# Altium project LNA.PrjPcb
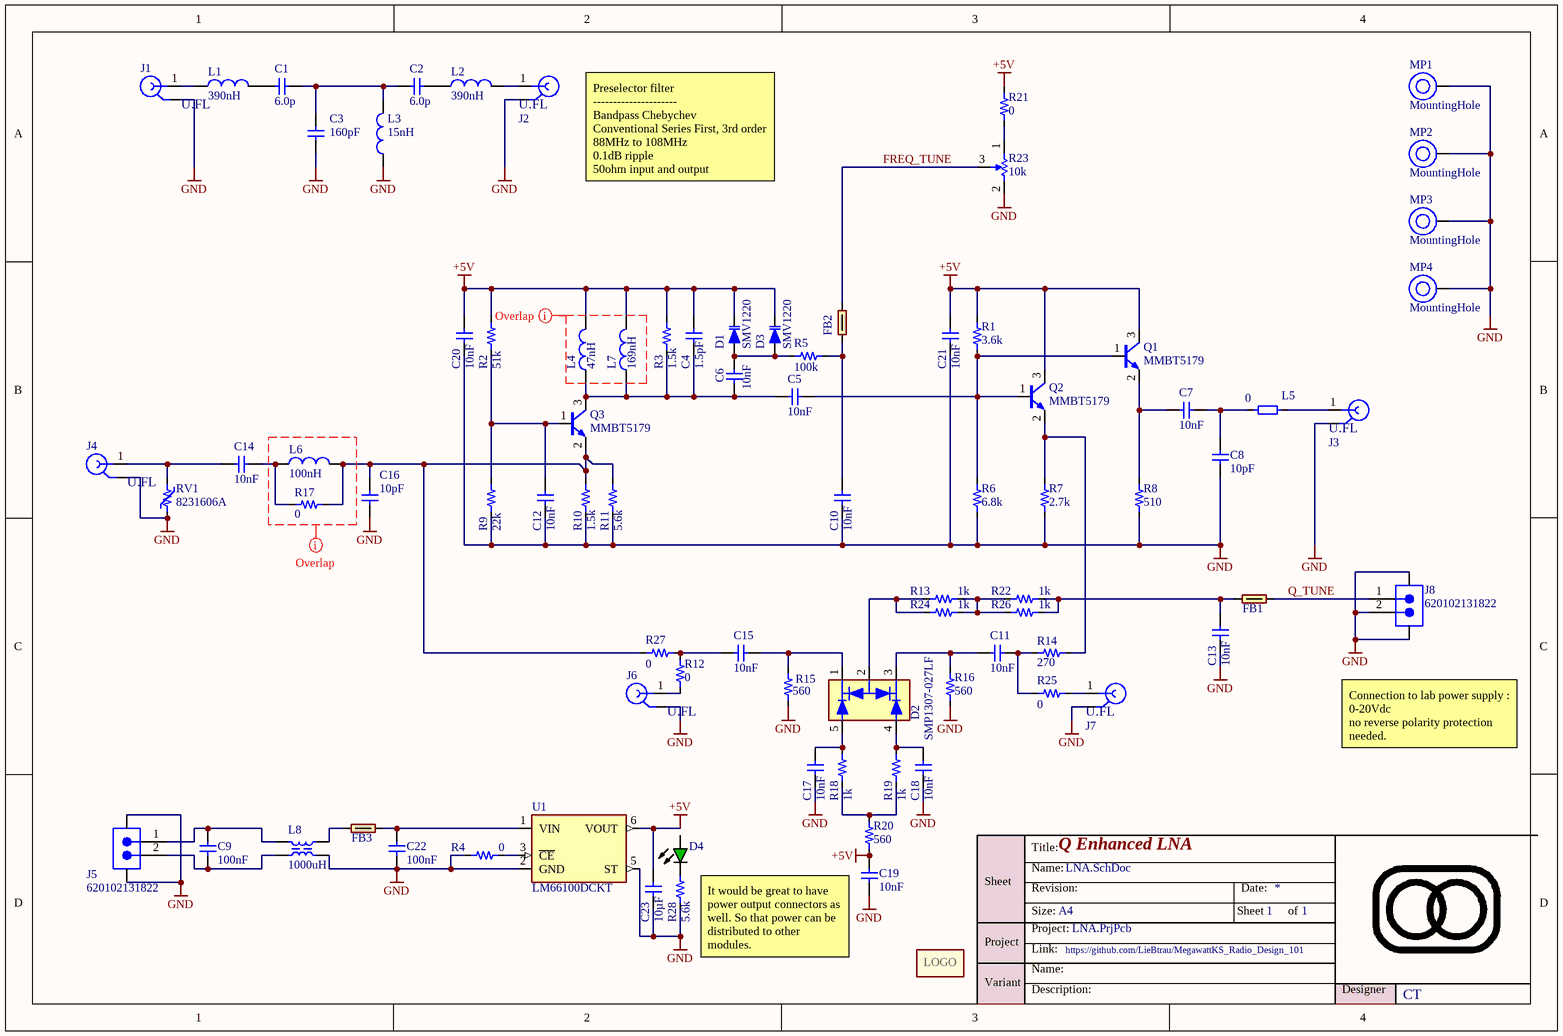
[diagram p0: LNA.SchDoc]
Project_link: https://github.com/LieBtrau/MegawattKS_Radio_Design_101; board_revision: 1.0; board_name: LNA; assembly_revision: 1
1 sheet, 84 parts. Net scope: global (net labels, ports and power ports of the same name join across sheets).
Board file: LNA.PcbDoc

## Sheet LNA.SchDoc: Q Enhanced LNA
size A4; Author: CT; Engineer: CT; SheetNumber: 1; SheetTotal: 1; SPICEModelCacheWKYEMNAT: <root> / <DocumentId>WKYEMNAT</DocumentId> / </root>

### Parts
C1  value 6.0p  [0603-C-L]  (hidden comment: AC0603CRNPO9BN6R0)
C2  value 6.0p  [0603-C-L]  (hidden comment: AC0603CRNPO9BN6R0)
C3  value 160pF  [0603-C-N]  (hidden comment: C0603C161F5GACTU)
C4  value 1.5pF  [0603-C-L]  (hidden comment: Capacitor 1.5pF +/-0.5pF 50V NP0 0603)
C5  value 10nF  [0603-C-N]  (hidden comment: Capacitor 10nF 50V NP0 0603)
C6  value 10nF  [0603-C-N]  (hidden comment: Capacitor 10nF 50V NP0 0603)
C7  value 10nF  [0603-C-N]  (hidden comment: Capacitor 10nF 50V NP0 0603)
C8  value 10pF  [0603-C-N]  (hidden comment: Capacitor 10pF +/-5% 50V NP0 0603)
C9  value 100nF  [0603-C-N]  (hidden comment: Capacitor 100nF +/-10% 50V X7R 0603)
C10  value 10nF  [0603-C-N]  (hidden comment: Capacitor 10nF 50V NP0 0603)
C11  value 10nF  [0603-C-N]  (hidden comment: Capacitor 10nF 50V NP0 0603)
C12  value 10nF  [0603-C-N]  (hidden comment: Capacitor 10nF 50V NP0 0603)
C13  value 10nF  [0603-C-N]  (hidden comment: Capacitor 10nF 50V NP0 0603)
C14  value 10nF  [0603-C-N]  (hidden comment: Capacitor 10nF 50V NP0 0603)
C15  value 10nF  [0603-C-N]  (hidden comment: Capacitor 10nF 50V NP0 0603)
C16  value 10pF  [0603-C-N]  (hidden comment: Capacitor 10pF +/-5% 50V NP0 0603)
C17  value 10nF  [0603-C-N]  (hidden comment: Capacitor 10nF 50V NP0 0603)
C18  value 10nF  [0603-C-N]  (hidden comment: Capacitor 10nF 50V NP0 0603)
C19  value 10nF  [0603-C-N]  (hidden comment: Capacitor 10nF 50V NP0 0603)
C20  value 10nF  [0603-C-N]  (hidden comment: Capacitor 10nF 50V NP0 0603)
C21  value 10nF  [0603-C-N]  (hidden comment: Capacitor 10nF 50V NP0 0603)
C22  value 100nF  [0603-C-N]  (hidden comment: Capacitor 100nF +/-10% 50V X7R 0603)
C23  value 10µF  [WCAP-CSGP_1210_L3.2W2.5H2.5]  (hidden comment: Capacitor 10µF +/-10% 50V X7R 1210)
D1  value SMV1220  [FP-SOD523-MFG]  (hidden comment: SMV1220-079LF)
D2  SMP1307-027LF  [SOT25-N]
D3  value SMV1220  [FP-SOD523-MFG]  (hidden comment: SMV1220-079LF)
D4  150060GS84000  [WL-SMCW_0603_150060xx8x000]  (value not drawn)
FB1  742792662  [0603-FB-N]  (value not drawn)
FB2  742792662  [0603-FB-N]  (value not drawn)
FB3  742792662  [0603-FB-N]  (value not drawn)
J1  U.FL-R-SMT(10)  [HRS-U.FL-R-SMT_V]  (value not drawn)
J2  U.FL-R-SMT(10)  [HRS-U.FL-R-SMT_V]  (value not drawn)
J3  U.FL-R-SMT(10)  [HRS-U.FL-R-SMT_V]  (value not drawn)
J4  U.FL-R-SMT(10)  [HRS-U.FL-R-SMT_V]  (value not drawn)
J5  620102131822  [620102131822]
J6  U.FL-R-SMT(10)  [HRS-U.FL-R-SMT_V]  (value not drawn)
J7  U.FL-R-SMT(10)  [HRS-U.FL-R-SMT_V]  (value not drawn)
J8  620102131822  [620102131822]
L1  Inductance: 390nH  [WE-KI_1008]  (hidden comment: 744762239GA)
L2  Inductance: 390nH  [WE-KI_1008]  (hidden comment: 744762239GA)
L3  Inductance: 15nH  [WE-KI_1008]  (hidden comment: 744762115GA)
L4  Inductance: 47nH  [WE-CAIR_4248]  (hidden comment: 744912147)
L5  value 0  [1206-R-N]  (hidden comment: Jumper 0R <50 mOhm 2A 1206)
L6  Inductance: 100nH  [WE-KI_1008]  (hidden comment: 744762210GA)
L7  Inductance: 169nH  [WE-CAIR_5910]  (hidden comment: AIAC-4125C-R169J-T)
L8  Inductance: 1000uH  [WE-SL2_L9.2W6H5]  (hidden comment: 744222)
M1  Logo  [LOGO_9x6mm]  (value not drawn)  (no BOM)
MP1  MountingHole  [PTH-M3D6.5_VIA-RING]  (no BOM)
MP2  MountingHole  [PTH-M3D6.5_VIA-RING]  (no BOM)
MP3  MountingHole  [PTH-M3D6.5_VIA-RING]  (no BOM)
MP4  MountingHole  [PTH-M3D6.5_VIA-RING]  (no BOM)
Q1  MMBT5179  [SOT-23-3-N]
Q2  MMBT5179  [SOT-23-3-N]
Q3  MMBT5179  [SOT-23-3-N]
R1  value 3.6k  [0603-R-N]  (hidden comment: Resistor 3.6k +/-0.1W 1% 0603)
R2  value 51k  [0603-R-N]  (hidden comment: Resistor 51k +/- 1% 50V 0603)
R3  value 1.5k  [0603-R-N]  (hidden comment: Resistor 1.5k +/-1% 50V 0603)
R4  value 0  [0603-R-N]  (hidden comment: Jumper 0R <50 mOhm 1A 0603)
R5  value 100k  [0603-R-N]  (hidden comment: Resistor 100k +/-1% 50V 0603)
R6  value 6.8k  [0603-R-N]  (hidden comment: Resistor 6.8k +/-1% 0.1W 0603)
R7  value 2.7k  [0603-R-N]  (hidden comment: Resistor 2.7k +/-1% 0.1W 0603)
R8  value 510  [0603-R-N]  (hidden comment: Resistor 510R +/-1% 0.1W 0603)
R9  value 22k  [0603-R-N]  (hidden comment: Resistor 22k +/-1% 50V 0603)
R10  value 1.5k  [0603-R-N]  (hidden comment: Resistor 1.5k +/-1% 50V 0603)
R11  value 5.6k  [0603-R-N]  (hidden comment: Resistor 5.6k +/-1% 0.1W 0603)
R12  value 0  [0603-R-N]  (hidden comment: Jumper 0R <50 mOhm 1A 0603)
R13  value 1k  [0603-R-N]  (hidden comment: Resistor 1k +/-1% 50V 0603)
R14  value 270  [0603-R-N]  (hidden comment: Resistor 270R +/-1% 50V 0603)
R15  value 560  [0603-R-N]  (hidden comment: Resistor 560R +/-1% 0.1W 0603)
R16  value 560  [0603-R-N]  (hidden comment: Resistor 560R +/-1% 0.1W 0603)
R17  value 0  [0805-R-N]  (hidden comment: Jumper 0R <50 mOhm 2A 0805)
R18  value 1k  [0603-R-N]  (hidden comment: Resistor 1k +/-1% 50V 0603)
R19  value 1k  [0603-R-N]  (hidden comment: Resistor 1k +/-1% 50V 0603)
R20  value 560  [0603-R-N]  (hidden comment: Resistor 560R +/-1% 0.1W 0603)
R21  value 0  [0603-R-N]  (hidden comment: Jumper 0R <50 mOhm 1A 0603)
R22  value 1k  [0603-R-N]  (hidden comment: Resistor 1k +/-1% 50V 0603)
R23  value 10k  [BOUR-3296W]  (hidden comment: 3296W-1-103LF)
R24  value 1k  [0603-R-N]  (hidden comment: Resistor 1k +/-1% 50V 0603)
R25  value 0  [0603-R-N]  (hidden comment: Jumper 0R <50 mOhm 1A 0603)
R26  value 1k  [0603-R-N]  (hidden comment: Resistor 1k +/-1% 50V 0603)
R27  value 0  [0603-R-N]  (hidden comment: Jumper 0R <50 mOhm 1A 0603)
R28  value 5.6k  [0603-R-N]  (hidden comment: Resistor 5.6k +/-1% 0.1W 0603)
RV1  8231606A  [0603-VAR-N]
U1  LM66100DCKT  [SOT-363-N]

### Nets
+5V: C4.2 C19.1 C20.1 C21.1 C23.2 D1.1(K) D3.1(K) L4.2 L7.2 Q1.3(C) Q2.3(C) R1.2 R2.2 R3.2 R20.1 R21.2 U1.6(VOUT)
GND: C3.1 C8.2 C10.2 C12.2 C13.1 C16.1 C17.2 C18.1 C19.2 C20.2 C21.2 C22.1 C23.1 J1.2(GND) J2.2(GND) J3.2(GND) J4.2(GND) J5.MP1 J5.MP2 J6.2(GND) J7.2(GND) J8.2 J8.MP1 J8.MP2 L3.1 L8.3 MP1.1(H1) MP2.1(H1) MP3.1(H1) MP4.1(H1) R4.2 R6.1 R7.1 R8.1 R9.1 R10.1 R11.1 R15.1 R16.1 R23.2(B) R28.1 RV1.1 U1.2(GND) U1.5(ST)
FREQ_TUNE: FB2.2 R23.3(TAP)
Q_TUNE: FB1.1 J8.1
NetC1_1: C1.1 C2.2 C3.2 L3.2
NetC1_2: C1.2 L1.2
NetC2_1: C2.1 L2.1
NetC4_1: C4.1 C5.1 C6.2 L4.1 L7.1 Q3.3(C) R3.1
NetC5_2: C5.2 Q1.1(B) Q2.1(B) R1.1 R6.2
NetC6_1: C6.1 D1.2(A) D3.2(A) R5.1
NetC7_1: C7.1 Q1.2(E) R8.2
NetC7_2: C7.2 C8.1 L5.1
NetC9_1: C9.1 J5.2 L8.4
NetC9_2: C9.2 J5.1 L8.1
NetC10_1: C10.1 FB2.1 R5.2
NetC11_1: C11.1 R14.1 R25.2
NetC11_2: C11.2 D2.3 R16.2
NetC12_1: C12.1 Q3.1(B) R2.1 R9.2
NetC13_2: C13.2 FB1.2 R22.2 R26.2
NetC14_1: C14.1 J4.1(SIG) RV1.2
NetC14_2: C14.2 L6.1 R17.1
NetC15_1: C15.1 D2.1 R15.2
NetC15_2: C15.2 R12.2 R27.1
NetC16_2: C16.2 L6.2 Q3.2(E) R10.2 R11.2 R17.2 R27.2
NetC17_1: C17.1 D2.5 R18.1
NetC18_2: C18.2 D2.4 R19.1
NetC22_2: C22.2 FB3.1 U1.1(VIN)
NetD2_2: D2.2 R13.1 R24.1
NetFB3_2: FB3.2 L8.2
NetJ1_1: J1.1(SIG) L1.1
NetJ2_1: J2.1(SIG) L2.2
NetJ3_1: J3.1(SIG) L5.2
NetJ6_1: J6.1(SIG) R12.1
NetJ7_1: J7.1(SIG) R25.1
NetQ2_2: Q2.2(E) R7.2 R14.2
NetR4_1: R4.1 U1.3(~{CE})
NetR13_2: R13.2 R22.1 R24.2 R26.1
NetR18_2: R18.2 R19.2 R20.2
NetR21_1: R21.1 R23.1(A)

Not connected (* = marked no-connect by the designer): D4 1(K) 2(A); R28 2

### Layout directives
CompClassName: Overlap: (no net found under the mark)

### Notes on the sheet
- Preselector filter
  ---------------------
  Bandpass Chebychev
  Conventional Series First, 3rd order
  88MHz to 108MHz
  0.1dB ripple
  50ohm input and output
- Connection to lab power supply : 0-20Vdc
  no reverse polarity protection needed.
- It would be great to have power output connectors as well. So that power can be distributed to other modules.
- Title:
- Sheet
- Size:
- Name:
- Revision:
- A4
- Date:
- of
- Project
- Variant
- Project:
- Link:
- Description:
- Designer
- (in symbol Logo) LOGO

### Library data of the parts
C1 C2 = CMP-001-00148-1: Multilayer Ceramic Capacitor, 6 pF, 50 V, ± 0.25pF, C0G (NP0), 0603 [1608 Metric]; Capacitor Type: MLCC; Insulation Resistance: 10GO; Q Factor: 536; Voltage Rating: 50V; Usage: General Purpose; Dielectric: NP0; ComponentLink1URL: https://www.we-online.com/redexpert/article/885012006050?ad; Pins: 2; Min Operating Temperature: -55°C; ComponentLink2URL: https://www.we-online.com/redexpert/spec/885012006050?ad; Width: 0.8mm; Max Operating Temperature: 125°C; Mounting Technology: SMT; ComponentLink2Description: Datasheet Link; ComponentLink1Description: Website Link; Length: 1.6mm; Packaging: Tape and Reel; Height: 0.8mm; Case/Package: 0603
C3 = CMP-001-00149-1: Cap Ceramic 160pF 50V C0G 1% Pad SMD 0603 125C Extreme Low ESR T/R; Mounting Technology: Surface Mount; RoHS Compliant: Yes; Termination: SMD/SMT; Case/Package: 0603; Tolerance: 1%; Min Operating Temperature: -55°C; Packaging: Tape and Reel; Case Code (Metric): 1608; JLCPCB Part #: C107041; Thickness: 0.034inch; Width: 0.031inch; Length: 0.063inch; Max Operating Temperature: 125°C; Case Code (Imperial): 0603; Weight: 7.1E-05oz; Voltage Rating: 50V; Dielectric: C0G; Series: CC; Voltage Rating (DC): 50V; Lead Free: Lead Free; Package Quantity: 4000; Dielectric Material: Ceramic; Height: 0.8mm
C4 = CMP-072-000117-14: WCAP-CSGP Multilayer Ceramic Chip Capacitor, General Purpose, size 0603, NP0, 1.5pF, 50VDC; Q Factor: 430; Technical Reference: NP006031R5D050DFCT10000; Insulation Resistance: 10GO; Capacitor Type: MLCC; Tolerance: 0.5pF; Usage: General Purpose; Case/Package: 0603; Height: 0.8mm; ComponentLink2URL: https://www.we-online.com/redexpert/spec/885012006046?ad; Dielectric: NP0; Width: 0.8mm; Mounting Technology: SMT; Voltage Rating: 50V; Length: 1.6mm; ComponentLink2Description: Datasheet Link; ComponentLink1Description: Website Link; Design Item ID: 885012006046; Pins: 2; Max Operating Temperature: 125°C; Min Operating Temperature: -55°C; Packaging: Tape and Reel; Source: WCAP-CSGP.SchLib; Match Code: WCAP-CSGP; ComponentLink1URL: https://www.we-online.com/redexpert/article/885012006046?ad
C5-C7 C10-C15 C17-C21 = CMP-001-00137-7: Multilayer Ceramic Capacitor, Grm Series, 0.01 F, 5%, C0g / Np0, 50 V, 0603 [1608 Metric]; FLIR Part #: YCAM10N-7; Page Part #: CCQJ103T; Temperature Coefficient: 30ppm/°C; Reach SVHC Compliant: No; Case/Package: 0603; Thickness: 0.035inch; Width: 0.8mm; Case Code (Metric): 1608; Termination: SMD/SMT; Min Operating Temperature: -55°C; Voltage Rating (DC): 50V; Mounting Technology: Surface Mount; Package Quantity: 4000; Depth: 0.8mm; Dielectric: C0G; Packaging: Cut Tape; Voltage: 50V; Max Operating Temperature: 125°C; RoHS Compliant: Yes; Material: Ceramic; Lead Pitch: 0.5mm; Case Code (Imperial): 0603; Tolerance: 5%; Voltage Rating: 50V; Lead Free: Lead Free; Height: 0.8mm; Length: 1.6mm; JLCPCB Part #: C85973; Series: GRM
C8 = CMP-072-000122-18: WCAP-CSGP Multilayer Ceramic Chip Capacitor, General Purpose, size 0603, NP0, 10pF, 50VDC; Page Part #: CCQJ100; Technical Reference: NP00603100J050DFCT10000; Insulation Resistance: 10GO; Tolerance: 5%; Capacitor Type: MLCC; Q Factor: 600; Usage: General Purpose; Design Item ID: 885012006051; Case/Package: 0603; Voltage Rating: 50V; Match Code: WCAP-CSGP; Source: WCAP-CSGP.SchLib; Width: 0.8mm; Length: 1.6mm; Mounting Technology: SMT; Min Operating Temperature: -55°C; ComponentLink2URL: https://www.we-online.com/redexpert/spec/885012006051?ad; JLCPCB Part #: C106245; Dielectric: NP0; ComponentLink2Description: Datasheet Link; Packaging: Tape and Reel; Pins: 2; Max Operating Temperature: 125°C; ComponentLink1URL: https://www.we-online.com/redexpert/article/885012006051?ad; ComponentLink1Description: Website Link; Height: 0.8mm
C9 C22 = CMP-072-000619-16: WCAP-CSGP Multilayer Ceramic Chip Capacitor, General Purpose, size 0603, X7R, 100nF, 50VDC; Tolerance: 10%; Insulation Resistance: 5GO; Capacitor Type: MLCC; Dissipation Factor: 3%; Technical Reference: X7R0603104K050DFCT10000; Max Operating Temperature: 125°C; Pins: 2; Match Code: WCAP-CSGP; Case/Package: 0603; Source: WCAP-CSGP.SchLib; Width: 0.8mm; ComponentLink2Description: Datasheet Link; Mounting Technology: SMT; ComponentLink2URL: https://www.we-online.com/redexpert/spec/885012206095?ad; JLCPCB Part #: C14663; Packaging: Tape and Reel; Height: 0.8mm; Length: 1.6mm; Usage: General Purpose; Voltage Rating: 50V; ComponentLink1Description: Website Link; Min Operating Temperature: -55°C; ComponentLink1URL: https://www.we-online.com/redexpert/article/885012206095?ad; Design Item ID: 885012206095; Dielectric: X7R
C16 = CMP-072-000122-18: WCAP-CSGP Multilayer Ceramic Chip Capacitor, General Purpose, size 0603, NP0, 10pF, 50VDC; Page Part #: CCQJ100; Capacitor Type: MLCC; Insulation Resistance: 10GO; Technical Reference: NP00603100J050DFCT10000; Q Factor: 600; Tolerance: 5%; Dielectric: NP0; ComponentLink1URL: https://www.we-online.com/redexpert/article/885012006051?ad; Pins: 2; Min Operating Temperature: -55°C; ComponentLink2URL: https://www.we-online.com/redexpert/spec/885012006051?ad; Width: 0.8mm; Max Operating Temperature: 125°C; Mounting Technology: SMT; ComponentLink2Description: Datasheet Link; Voltage Rating: 50V; Usage: General Purpose; ComponentLink1Description: Website Link; Length: 1.6mm; Source: WCAP-CSGP.SchLib; Design Item ID: 885012006051; Packaging: Tape and Reel; Height: 0.8mm; Case/Package: 0603; Match Code: WCAP-CSGP; JLCPCB Part #: C106245
C23 = CMP-072-000922-16: WCAP-CSGP Multilayer Ceramic Chip Capacitor, General Purpose, size 1210, X7R, 10µF, 50VDC; Dissipation Factor: 10%; Capacitor Type: MLCC; Insulation Resistance: 0.01GO; Technical Reference: X7R1210106K050DFCT10000; Max Operating Temperature: 125°C; Mounting Technology: SMT; Pins: 2; Height: 2.5mm; ComponentLink2Description: Datasheet Link; ComponentLink1Description: Website Link; Packaging: Tape and Reel; Source: WCAP-CSGP.SchLib; Length: 3.2mm; Width: 2.5mm; Design Item ID: 885012209073; ComponentLink2URL: https://www.we-online.com/redexpert/spec/885012209073?ad; Usage: General Purpose; ComponentLink1URL: https://www.we-online.com/redexpert/article/885012209073?ad; Dielectric: X7R; Case/Package: 1210; Match Code: WCAP-CSGP; Voltage Rating: 50V; Min Operating Temperature: -55°C; JLCPCB Part #: C77102; Tolerance: 10%
D1 D3 = CMP-004-00057-3: Diode, Varactor, SC79 N-Type; Max Operating Temperature: 125°C; Case/Package: SC; RoHS Compliant: Yes; Series: -; Min Operating Temperature: -55°C; Mounting Technology: Surface Mount; Packaging: Cut Tape
D2 = CMP-004-00058-1: Dio Sw 0.85V 200V 10MA SOT5; Max Power Dissipation: 250mW; Forward Voltage: 850mV; Termination: SMD/SMT; Max Operating Temperature: 150°C; Series: -; RoHS Compliant: Yes; Min Operating Temperature: -65°C; Reverse Voltage: 200V; Forward Current: 10mA; Power Dissipation: 250mW; Radiation Hardening: No; Packaging: Tape and Reel; Height: 1.63mm; Mounting Technology: Surface Mount; Package Quantity: 3000; Reverse Voltage (DC): 200V; Weight: 0.000557oz; Pins: 5; Case/Package: SOT-5
D4 = CMP-002-001076-16: WL-SMCW Mono-color Chip LED Waterclear, size 0603, Green, 3.3V, 40°; Manufacturer: Wurth Elektronik; Page Part #: MOVPA-0270A; Chip Technology: InGaN; Case/Size Code: 0603; Luminous Intensity: 3000mcd; Peak Wavelength: 520nm; Dominant Wavelength: 525nm; Mount: Surface Mount; Design Item ID: 150060GS84000; Category: Signal LEDs; Component Type: Standard; Emitting Color: Green; Viewing Angle: 40°; Height: 0.95mm; Width: 0.8mm; Length: 1.6mm; JLCPCB Part #: C7429914; Packaging: Tape and Reel; Match Code: WL-SMCW; ComponentLink2Description: Datasheet Link; Forward Voltage: 3.3V; ComponentLink1Description: Website Link; ComponentLink2URL: https://www.we-online.com/redexpert/spec/150060GS84000?ad; Source: WL-SMCW.SchLib; Operating Temperature Max: 85°C; Manufacturer Part Number: 150060GS84000; Pin Count: 2; Operating Temperature Min: -40°C; ComponentLink1URL: https://www.we-online.com/redexpert/article/150060GS84000?ad
FB1-FB3 = CMP-066-000126-8: WE-CBF SMT EMI Suppression Ferrite Bead, size 0603, 1000O, 0.83A; Manufacturer: Wurth Elektronik; Page Part #: FILTER279; Case/Size Code: 0603; Impedance Max Test Condition: 120MHz; Type: Wide Band; DC Resistance Max: 0.3O; Impedance Max: 1050O; Rated Current: 0.6A; Mount: Surface Mount; Impedance @100MHz: 1000O; JLCPCB Part #: C180490; ComponentLink1URL: https://www.we-online.com/redexpert/article/742792662?ad; ComponentLink2URL: https://www.we-online.com/redexpert/spec/742792662?ad; Length: 1.6mm; ComponentLink1Description: Website Link; Manufacturer Part Number: 742792662; Width: 0.8mm; Match Code: WE-CBF; Component Type: Standard; Design Item ID: 742792662; Pin Count: 2; Operating Temperature Max: 125°C; Packaging: Tape and Reel; ComponentLink2Description: Datasheet Link; Operating Temperature Min: -55°C; Category: Ferrites for PCB Assembly; Height: 0.8mm
J1-J4 J6 J7 = CMP-002-00035-12: Ultra Small Surface Mount Coaxial Connector, 50 Ohm, -40 to 90 degC, 3-Pin SMD, RoHS, Tape and Reel; pin to pad: 1>3 2>1+2; Manufacturer: Hirose Electric; Connector Type: RF&Coax; Impedance: 50Ohm; Value: U.FL; Case/Package: U.FL-R-SMT; Package Quantity: 2500; Packaging: TapeandReel; RoHS Compliant: True; Contact Material: Brass; Contact Plating: Gold; Min Operating Temperature: -40°C; JLCPCB Part #: C88373; Package Reference: U.FL-R-SMT; Datasheet Version: Aug-16; Manufacturer URL: https://www.hirose.com; Max Operating Temperature: 90°C; Fastening Type: Snap; Package Description: 3-Pin Surface Mount Device, Body 2.6 x 2.6 mm; Resistance: 50Ohm; Mounting Technology: SM; Datasheet URL: https://www.hirose.com/product/en/download_file/key_name/U.FL/category/Catalog/doc_file_id/31697/?file_category_id=4&item_id=15&is_series=1
J5 J8 = CMP-047-000040-15: WR-WTB SMT Male Horizontal Shrouded Header, pitch 2mm, 2p; Page Part #: K620102131822; Pin Number: 2; Rated Current: 2A; Contact Resistance: 20mOhm; Value: JST-PH; Withstanding Voltage: 800VAC; Working Voltage: 100VAC; Source: WR-WTB_2.00mm.SchLib; Operating Temperature: -25 to +85degC; JLCPCB Part #: C295747; Pin Count: 2; Pitch: 2mm; Part Number: 620102131822; Component Type: Standard; Packaging: Tape and Reel; Type: Horizontal; Publisher: Wurth Elektronik; Gender: Male; ComponentLink2Description: Datasheet; ComponentLink1Description: Manufacturer; Mounting Technology: SMT; ComponentLink1URL: http://www.we-online.de; ComponentLink2URL: https://www.we-online.com/catalog/datasheet/620102131822.pdf; Published Date: January 2020; Design Item ID: 620102131822
L1 L2 = CMP-051-000215-6: WE-KI SMT Wire Wound Ceramic Inductor, size 1008, 390nH, 0.47A; Manufacturer: Wurth Elektronik; Case/Size Code: 1008; Q Factor: 45; Inductance Tolerance: +/-2%; DC Resistance Max: 1.06Ohm; Self Resonant Frequency: 530MHz; ComponentLink2URL: https://www.we-online.com/catalog/datasheet/744762239GA.pdf; ComponentLink2Description: Datasheet; Match Code: WE-KI; Operating Temperature Max: 125°C; ComponentLink1URL: http://www.we-online.de; Length: 2.5mm; Packaging: Tape and Reel; Height: 1.6mm; Design Item ID: 744762239GA; Manufacturer Part Number: 744762239GA; Pin Count: 2; ComponentLink1Description: Manufacturer Link; Source: WE-KI.SchLib; Rated Current: 0.47A; Category: RF Inductors; Width: 2mm; Mount: SMT; Operating Temperature Min: -40°C; Component Type: Standard
L3 = CMP-051-000181-6: WE-KI SMT Wire Wound Ceramic Inductor, size 1008, 15nH, 1A; Manufacturer: Wurth Elektronik; Q Factor: 60; Inductance Tolerance: +/-2%; Case/Size Code: 1008; DC Resistance Max: 0.08Ohm; Self Resonant Frequency: 2700MHz; ComponentLink2Description: Datasheet; Manufacturer Part Number: 744762115GA; Component Type: Standard; ComponentLink2URL: https://www.we-online.com/catalog/datasheet/744762115GA.pdf; Source: WE-KI.SchLib; Rated Current: 1A; Height: 1.6mm; Length: 2.5mm; Packaging: Tape and Reel; Operating Temperature Max: 125°C; Match Code: WE-KI; Design Item ID: 744762115GA; Mount: SMT; Category: RF Inductors; Operating Temperature Min: -40°C; ComponentLink1URL: http://www.we-online.de; Pin Count: 2; ComponentLink1Description: Manufacturer Link; Width: 2mm
L4 = CMP-165-000017-2: WE-CAIR SMT Air Coil, size 4248, 47nH, 3A, 5.6mO; Manufacturer: Wurth Elektronik; Q Factor: 100; Self Resonant Frequency: 2.1GHz; Case/Size Code: 4248; Inductance Tolerance: 5%; Rated Current: 3A; Source: WE-CAIR.SchLib; ComponentLink2Description: Datasheet Link; Width: 3.81mm; Component Type: Standard; Height: 4.2mm; Operating Temperature Min: -40°C; Manufacturer Part Number: 744912147; Packaging: Tape and Reel; Match Code: WE-CAIR; ComponentLink1Description: Website Link; Pin Count: 2; ComponentLink1URL: https://www.we-online.com/redexpert/article/744912147?ad; Length: 4.83mm; Category: RF Inductors; Mount: Surface Mount; Design Item ID: 744912147; ComponentLink2URL: https://www.we-online.com/redexpert/spec/744912147?ad; DC Resistance Max: 5.6mO; Operating Temperature Max: 125°C
L5 = CMP-009-00002-23: Chip Jumper, Thick Film, Jumper, 1206, 250mW, 2A, 0 Ohm, <50 mOhm; Elements: 1; Voltage Rating: 200V; Tolerance: 50 mOhm; Pins: 2; Usage: Jumper; Current Rating: 2A; Max Operating Temperature: 155°C; JLCPCB Part #: C17888; Min Operating Temperature: -55°C; Mounting Technology: SMT; RoHS Compliant: True; Resistor Type: Thick Film; Power Rating: 250mW; Case/Package: 1206
L6 = CMP-051-000201-6: WE-KI SMT Wire Wound Ceramic Inductor, size 1008, 100nH, 1A; Manufacturer: Wurth Elektronik; Q Factor: 60; Inductance Tolerance: +/-2%; DC Resistance Max: 0.18Ohm; Self Resonant Frequency: 1100MHz; Case/Size Code: 1008; Component Type: Standard; Mount: SMT; Length: 2.5mm; ComponentLink1URL: http://www.we-online.de; Category: RF Inductors; Operating Temperature Min: -40°C; Width: 2mm; Packaging: Tape and Reel; ComponentLink1Description: Manufacturer Link; Design Item ID: 744762210GA; Operating Temperature Max: 125°C; Source: WE-KI.SchLib; Manufacturer Part Number: 744762210GA; Rated Current: 1A; Height: 1.6mm; Match Code: WE-KI; ComponentLink2Description: Datasheet; Pin Count: 2; ComponentLink2URL: https://www.we-online.com/catalog/datasheet/744762210GA.pdf
L7 = CMP-006-00045-1: 169nH, 3.0A, Air Core, 5%, Unshielded, 12.0 mOhm Max, 100@50MHz, 0.8GHz, Air, 9.0 x 4.4 x 4.6mm, Surface Mount, Tape & Reel, 1kpcs/Reel; Case/Size Code: 5910; Rated Current: 3A; Q Factor: 100; Self Resonant Frequency: 800MHz; DC Resistance (DCR): 12mR; Test Frequency: 50MHz; Packaging: Tape and Reel; Category: RF Inductors; ComponentLink1Description: Website Link; Operating Temperature Min: -40°C; Width: 4.4mm; ComponentLink1URL: https://www.we-online.com/redexpert/article/744918222?ad; ComponentLink2URL: https://www.we-online.com/redexpert/spec/744918222?ad; Inductance Tolerance: 5%; Mount: Surface Mount; Pin Count: 2; Height: 5.9mm; Operating Temperature Max: 125°C; Component Type: Standard; ComponentLink2Description: Datasheet Link; Length: 4.6mm; Case/Package: Nonstandard; Mounting Technology: Surface Mount; Package Quantity: 1000; Series: AIAC-4125C; Value: 169nH; Lead Pitch: 9mm; Termination: SMD/SMT; Min Operating Temperature: -40°C; Core Material: Air; Max Operating Temperature: 125°C; Shielding: Unshielded; Max DC Current: 3A; RoHS Compliant: Yes
L8 = CMP-090-000004-5: WE-SL2 SMT Common Mode Line Filter, 1000uH, 0.8A, 0.207Ohm; pin to pad: 2>4 4>2; Manufacturer: Wurth Elektronik; Page Part #: L744222; Impedance Max: 6000Ohm; Number of Windings: 2; Rated Voltage: 80V; Winding Style: bifilar; Operating Temperature Min: -40°C; Manufacturer Part Number: 744222; Length: 9.2mm; DC Resistance Max: 0.207Ohm; Height: 5mm; Rated Current: 0.8A; Design Item ID: 744222; ComponentLink2URL: https://www.we-online.com/redexpert/spec/744222?ad; Pin Count: 4; Source: WE-SL2.SchLib; JLCPCB Part #: C2829007; Width: 6mm; Component Type: Standard; Packaging: Tape and Reel; Category: Common Mode Chokes; ComponentLink1Description: Manufacturer Link; Mount: Surface Mount; ComponentLink1URL: https://www.we-online.com/redexpert/article/744222?ad; Operating Temperature Max: 125°C; ComponentLink2Description: Datasheet; Match Code: WE-SL2
MP1-MP4 = CMP-00028-00004-15: Mounting hole.  Add this so that mounting holes placed in your design don't automagically disappear when you import changes from the schematic.; Pins: 1
Q1-Q3 = CMP-013-00064-1: MMBT5179 Series 12 V CE Breakdown .05 A NPN RF Transistor - SOT-23; Number of Elements: 1; Gain Bandwidth Product: 2GHz; Continuous Collector Current: 50mA; Collector Base Voltage (VCBO): 20V; Collector Emitter Voltage (VCEO): 12V; Max Power Dissipation: 225mW; Gain: 15dB; Operating Frequency: 2000 MHz; Collector Emitter Saturation Voltage: 400mV; hFE Min: 25; Emitter Base Voltage (VEBO): 2.5V; Radiation Hardening: No; Case/Package: SOT-23; Weight: 0.03g; Transition Frequency: 2GHz; Voltage Rating (DC): 12V; Collector Emitter Breakdown Voltage: 12V; Max Collector Current: 50mA; Max Breakdown Voltage: 12V; Series: -; Polarity: NPN; JLCPCB Part #: C416012; RoHS Compliant: Yes; Reach SVHC Compliant: No; Pins: 3; Package Quantity: 3000; Min Operating Temperature: -55°C; Mounting Technology: Surface Mount; Length: 2.92mm; Lead Free: Lead Free; Max Operating Temperature: 150°C; Packaging: Tape and Reel; Collector-emitter Voltage-Max: 12V; Current Rating: 50mA; Width: 1.3mm; Clock Frequency: 2GHz; Height: 0.93mm; Power Dissipation: 225mW; Frequency: 2GHz
R1 = CMP-009-00405-1: Res Thick Film 0603 3.6K Ohm 1% 0.1W(1/10W) ±100ppm/°C Pad SMD T/R; JLCPCB Part #: C22980; Case/Package: 0603; RoHS Compliant: Yes; Lead Free: Lead Free
R2 = CMP-009-00404-1: 100Mw Thick Film Resistors 100Ppm/ 1% 51K 0603 Chip Resistor Surface Mount Rohs; Temperature Coefficient: 100ppm/°C; Min Operating Temperature: -55°C; Tolerance: 1%; RoHS Compliant: Yes; Reach SVHC Compliant: No; JLCPCB Part #: C23196; Case/Package: 0603; Max Operating Temperature: 155°C; Voltage Rating: 50V; Features: Moisture Resistant; Resistor Type: Thick Film; Power Rating: 100mW; Pins: 2; Max Power Dissipation: 100mW; Termination: SMD/SMT; Depth: 0.8mm; Voltage Rating (DC): 50V; Packaging: Tape and Reel; Case Code (Metric): 1608; Series: RC; Width: 0.031inch; Package Quantity: 1; Number of Terminations: 2; Technology: THICK FILM; Resistance Tolerance: 1%; Length: 1.6mm; Case Code (Imperial): 0603; Height: 0.45mm
R3 = CMP-009-00201-21: Chip Resistor, Thick Film, General Purpose, 0603, 100mW, 50V, 1.5 kOhm, +/-1%; Tolerance: 1%; Elements: 1; Resistor Type: Thick Film; RoHS Compliant: Yes; Pins: 2; Voltage Rating: 50V; Min Operating Temperature: -55°C; Power Rating: 100mW; Mounting Technology: SMT; Usage: General Purpose; JLCPCB Part #: C22843; Case/Package: 0603; Max Operating Temperature: 155°C
R4 R12 R21 R25 R27 = CMP-009-00006-26: Chip Jumper, Thick Film, Jumper, 0603, 100mW, 1A, 0 Ohm, <50 mOhm; FLIR Part #: YRES0E-1; Page Part #: ROQJ0000; Elements: 1; Tolerance: 50 mOhm; Voltage Rating: 75V; Min Operating Temperature: -55°C; RoHS Compliant: True; Usage: Jumper; Mounting Technology: SMT; Max Operating Temperature: 155°C; Case/Package: 0603; JLCPCB Part #: C21189; Current Rating: 1A; Resistor Type: Thick Film; Power Rating: 100mW; Pins: 2
R5 = CMP-009-00023-28: Chip Resistor, Thick Film, General Purpose, 0603, 100mW, 50V, 100 kOhm, +/-1%; Page Part #: ROQF1003; Tolerance: 1%; Elements: 1; Max Operating Temperature: 155°C; Usage: General Purpose; Mounting Technology: SMT; Voltage Rating: 50V; Power Rating: 100mW; Min Operating Temperature: -55°C; RoHS Compliant: Yes; Pins: 2; Resistor Type: Thick Film; JLCPCB Part #: C25803; Case/Package: 0603
R6 = CMP-009-00291-11: Res Thick Film 0603 6.8K Ohm 1% 0.1W(1/10W) ±100ppm/C Pad SMD T/R; Power Rating: 100mW; Voltage Rating: 50V; Elements: 1; Usage: General Purpose; Temperature Coefficient: 100ppm/°C; Mounting Technology: SMT; Tolerance: 1%; Min Operating Temperature: -55°C; Max Operating Temperature: 155°C; Case/Package: 0603; Resistor Type: Thick Film; Pins: 2; RoHS Compliant: Yes; JLCPCB Part #: C23212; Reach SVHC Compliant: Yes; Lead Free: Lead Free; Features: Moisture Resistant
R7 = CMP-009-00257-14: Res Thick Film 0603 2.7K Ohm 1% 0.1W(1/10W) ±100ppm/C Pad SMD Automotive T/R; Voltage Rating: 75V; Power Rating: 100mW; Usage: Precision; Elements: 1; Temperature Coefficient: 100ppm/°C; Resistor Type: Thick Film; RoHS Compliant: Yes; Packaging: Tape and Reel; Pins: 2; Tolerance: 1%; Features: Automotive AEC-Q200; Min Operating Temperature: -55°C; Mounting Technology: SMT; JLCPCB Part #: C13167; Case/Package: 0603; Max Operating Temperature: 155°C; Lead Free: Lead Free
R8 = CMP-009-00339-5: SMD Chip Resistor, 510 Ohm, ± 1%, 100 mW, 0603 [1608 Metric], Thick Film, General Purpose; Power Rating: 100mW; Elements: 1; Voltage Rating: 50V; Temperature Coefficient: 100ppm/°C; JLCPCB Part #: C23193; Tolerance: 1%; Pins: 2; Resistor Type: Thick Film; RoHS Compliant: Yes; Case/Package: 0603; Min Operating Temperature: -55°C; Mounting Technology: SMT; Usage: General Purpose; Max Operating Temperature: 155°C; Reach SVHC Compliant: No; Features: Moisture Resistant; Lead Free: Lead Free
R9 = CMP-009-00245-17: Chip Resistor, Thick Film, General Purpose, 0603, 100mW, 50V, 22 kOhm, +/-1%; Tolerance: 1%; Elements: 1; Min Operating Temperature: -55°C; Power Rating: 100mW; Pins: 2; RoHS Compliant: Yes; Mounting Technology: SMT; Case/Package: 0603; Max Operating Temperature: 155°C; Usage: General Purpose; Voltage Rating: 50V; Resistor Type: Thick Film; JLCPCB Part #: C31850
R10 = CMP-009-00201-21: Chip Resistor, Thick Film, General Purpose, 0603, 100mW, 50V, 1.5 kOhm, +/-1%; Elements: 1; Tolerance: 1%; Usage: General Purpose; Case/Package: 0603; JLCPCB Part #: C22843; Mounting Technology: SMT; Min Operating Temperature: -55°C; Max Operating Temperature: 155°C; Pins: 2; Resistor Type: Thick Film; RoHS Compliant: Yes; Power Rating: 100mW; Voltage Rating: 50V
R11 R28 = CMP-009-00287-10: Res Thick Film 0603 5.6K Ohm 1% 0.1W(1/10W) ±100ppm/C Pad SMD T/R; Usage: General Purpose; Elements: 1; Temperature Coefficient: 100ppm/°C; Power Rating: 100mW; Voltage Rating: 75V; Case/Package: 0603; JLCPCB Part #: C23189; Mounting Technology: SMT; Min Operating Temperature: -55°C; Max Operating Temperature: 155°C; Pins: 2; Resistor Type: Thick Film; RoHS Compliant: Yes; Lead Free: Lead Free; Features: Moisture Resistant; Tolerance: 1%
R13 R18 R19 R22 R24 R26 = CMP-009-00014-29: Chip Resistor, Thick Film, General Purpose, 0603, 100mW, 50V, 1 kOhm, +/-1%; FLIR Part #: YRES1K-1; Page Part #: ROQF1001; Tolerance: 1%; Elements: 1; JLCPCB Part #: C21190; Pins: 2; Resistor Type: Thick Film; RoHS Compliant: Yes; Case/Package: 0603; Min Operating Temperature: -55°C; Power Rating: 100mW; Mounting Technology: SMT; Usage: General Purpose; Max Operating Temperature: 155°C; Voltage Rating: 50V
R14 = CMP-009-00178-27: Chip Resistor, Thick Film, General Purpose, 0603, 100mW, 50V, 270 Ohm, +/-1%; Tolerance: 1%; Elements: 1; Voltage Rating: 50V; Power Rating: 100mW; Mounting Technology: SMT; Max Operating Temperature: 155°C; JLCPCB Part #: C22966; Min Operating Temperature: -55°C; Case/Package: 0603; Usage: General Purpose; Resistor Type: Thick Film; Pins: 2
R15 R16 R20 = CMP-009-00400-1: SMD Chip Resistor, 560 Ohm, ï¿½ 1%, 100 mW, 0603 [1608 Metric], Thick Film, General Purpose; Voltage Rating: 75V; Power Rating: 100mW; Voltage Rating (DC): 50V; Temperature Coefficient: 100ppm/°C; Case Code (Imperial): 0603; Width: 0.8mm; Weight: 7.1E-05oz; Min Operating Temperature: -55°C; Case/Package: 0603; Series: RC; Termination: SMD/SMT; Military Standard: Not; Resistor Type: Thick Film; Depth: 0.8mm; Max Power Dissipation: 100mW; RoHS Compliant: Yes; Height: 0.45mm; Technology: THICK FILM; Construction: Rectangular; Pins: 2; JLCPCB Part #: C23204; Packaging: Tape and Reel; Reach SVHC Compliant: No; Package Quantity: 1; Tolerance: 1%; Lead Free: Lead Free; Voltage Rating (AC): 50V; Length: 1.6mm; Resistance Tolerance: 1%; Number of Terminations: 2; Case Code (Metric): 1608; Max Operating Temperature: 155°C; Features: Moisture Resistant
R17 = CMP-009-00007-20: Chip Jumper, Thick Film, Jumper, 0805, 125mW, 2A, 0 Ohm, <50 mOhm; Elements: 1; Voltage Rating: 150V; Tolerance: 50 mOhm; Pins: 2; Usage: Jumper; Current Rating: 2A; Max Operating Temperature: 155°C; Min Operating Temperature: -55°C; Mounting Technology: SMT; RoHS Compliant: True; Resistor Type: Thick Film; Power Rating: 125mW; Case/Package: 0805
R23 = CMP-009-00038-9: Square Trimpot(R) Trimming Potentiometer, 10 KOhm, +/- 10%, 0.5 W, -55 to 125 degC, 3-Pin THD, RoHS, Tube; pin to pad: 2>3 3>2; Voltage Rating: 300V; Elements: 1; Power Rating: 500mW; Min Operating Temperature: -55°C; JLCPCB Part #: C34846; Mounting Technology: THT; Datasheet Version: May-16; Max Operating Temperature: 150°C; Tolerance: 10%; Case/Package: 3296W; Pins: 3; Datasheet URL: http://www.bourns.com/docs/Product-Datasheets/3296.pdf; Usage: Potentiometer; Packaging: Rail/Tube; RoHS Compliant: True
RV1 = CMP-190-000000-2: WE-VE femtoF ESD Suppressor, size 0603, 6VDC, 0.05pF; Manufacturer: Wurth Elektronik; Operating Voltage (DC): 6V; ESD Contact Discharge Capability: 8kV; Clamping Voltage: 40V; Leakage Current: 0.05µA; ESD Air Discharge Capability: 15kV; Case/Size Code: 0603; Match Code: WE-VE femtoF; Category: ESD Protection; Width: 0.8mm; ComponentLink2Description: Datasheet Link; Design Item ID: 8231606A; ComponentLink1Description: Website Link; Operating Temperature Max: 85°C; Source: WE-VE femtoF.SchLib; ComponentLink1URL: https://www.we-online.com/redexpert/article/8231606A?ad; Mount: Surface Mount; Pin Count: 2; Manufacturer Part Number: 8231606A; Capacitance: 0.05pF; ComponentLink2URL: https://www.we-online.com/redexpert/spec/8231606A?ad; Packaging: Tape and Reel; Height: 0.5mm; Operating Temperature Min: -40°C; Length: 1.6mm; Component Type: Standard
U1 = CMP-019-00110-1: 1.5-V to 5.5-V, 1.5-A, 0.5-µA IQ ideal diode with integrated FET 6-SC70 -40 to 105; Max Output current: 1.5A; Turn-On Delay Time: 27us; Turn-Off Delay Time: 2us; Width: 1.25mm; Max Operating Temperature: 105°C; Pins: 6; Mounting Technology: Surface Mount; Min Operating Temperature: -40°C; Length: 2mm; Series: -; Thickness: 900um; Height: 1.1mm

## Assembly variants
B: not fitted J6 J7 L7 R12 R17 R25
A: not fitted C6 C8 C10 C11 C13 C15 C16 C17 C18 C19 D1 D2 D3 FB1 FB2 J6 J7 J8 L4 L6 Q2 R5 R7 R11 R12 R13 R14 R15 R16 R18 R19 R20 R21 R22 R23 R24 R25 R26 R27; alternate parts R3 -> CMP-009-00201-21